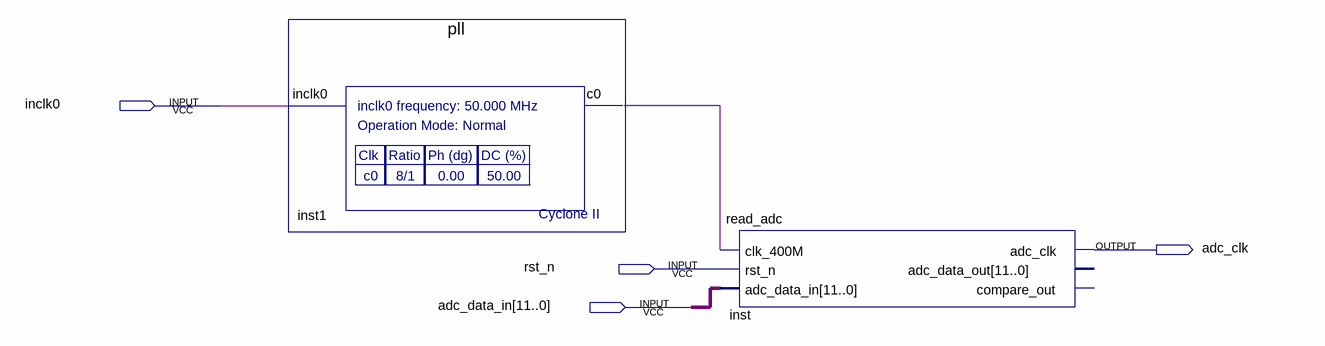
[diagram p0: schematic sheet]
// Quartus schematic ep2adc.bdf as structural Verilog: 2 symbols, 4 pins
module ep2adc (
  input  inclk0,
  input  rst_n,
  input  [11:0] adc_data_in,
  output adc_clk
);

  wire inst1_c0;

  pll inst1 (.inclk0(inclk0), .c0(inst1_c0));
  read_adc inst (
    .clk_400M(inst1_c0), .rst_n(rst_n), .adc_data_in(adc_data_in), .adc_clk(adc_clk));  // open: adc_data_out, compare_out
endmodule
